# Altium project TinyEmbedded_T133.PrjPcb
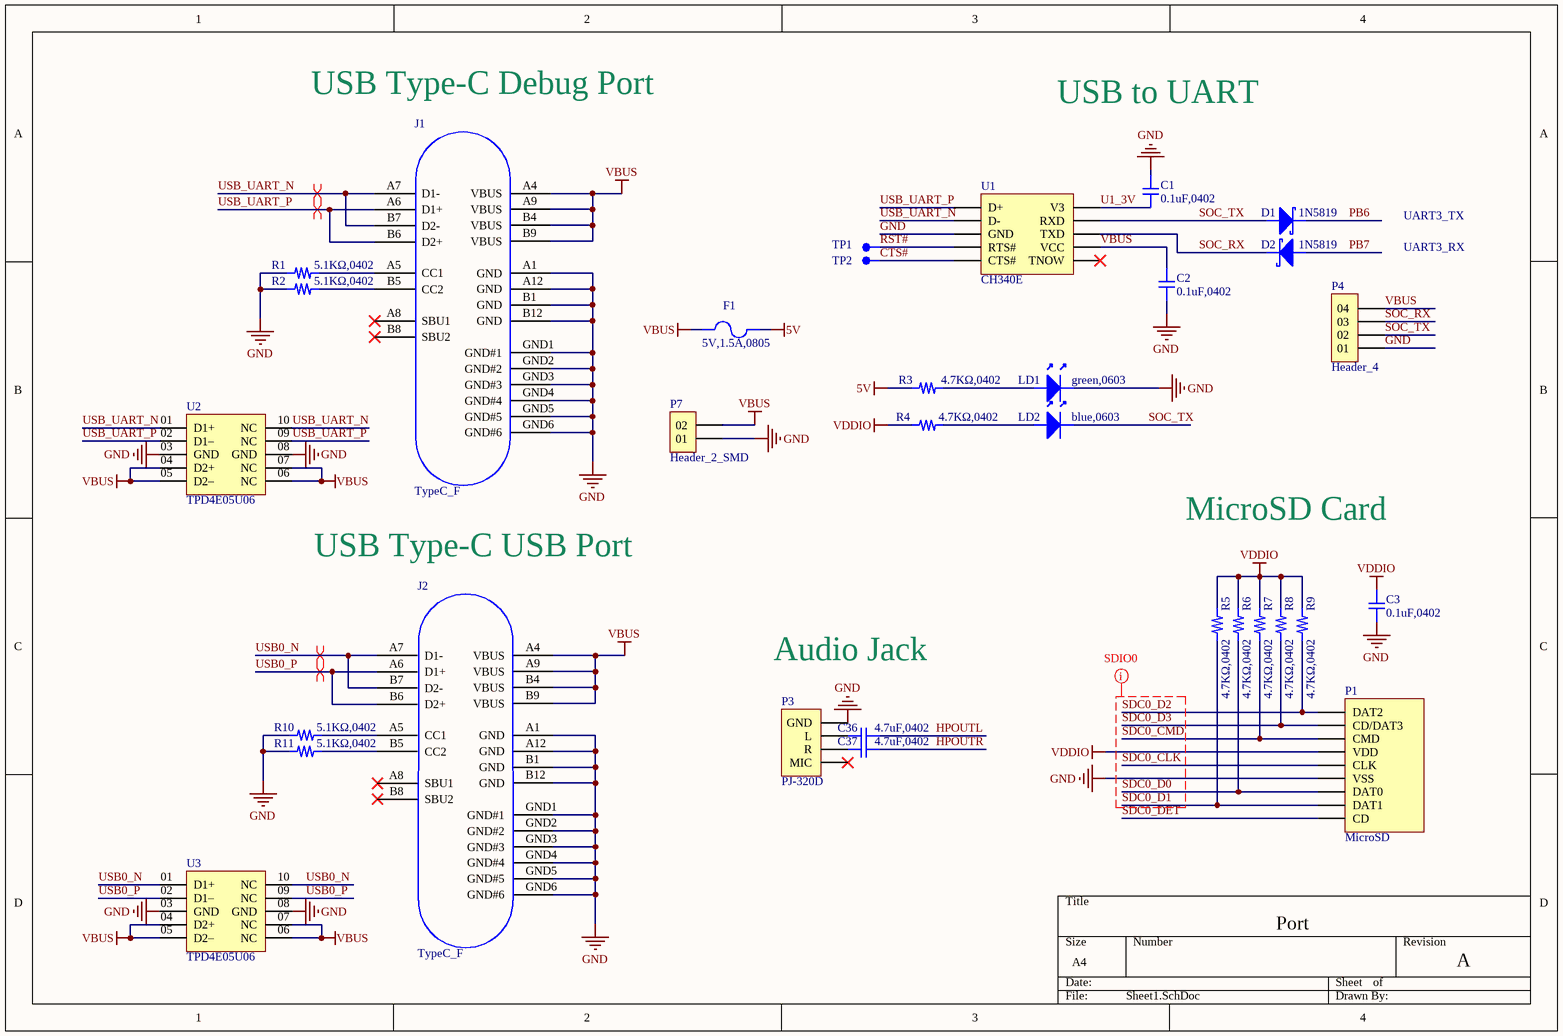
[diagram p0: Sheet1.SchDoc]
4 sheets, 121 parts. Net scope: global (net labels, ports and power ports of the same name join across sheets).
Board files: PCB1.PcbDoc, PCB2.PcbDoc
Sheets:
  Sheet1.SchDoc
  Sheet2.SchDoc
  Sheet3.SchDoc
  Sheet4.SchDoc

## Sheet Sheet1.SchDoc
size A4

### Parts
C1  0.1uF,0402  [C0402]
C2  0.1uF,0402  [C0402]
C3  0.1uF,0402  [C0402]
C36  4.7uF,0402  [C0402]
C37  4.7uF,0402  [C0402]
D1  1N5819  [SOD-323]
D2  1N5819  [SOD-323]
F1  5V,1.5A,0805  [F0805]
J1  TypeC_F  [Type-C_16P_F_0.5_DIP]
J2  TypeC_F  [Type-C_16P_F_0.5_DIP]
LD1  green,0603  [LED0603]
LD2  blue,0603  [LED0603]
P1  MicroSD  [MicroSD]
P3  PJ-320D  [PJ-320D]
P4  Header_4  [HEADER_4_SMD]
P7  Header_2_SMD  [HEADER_2_SMD]
R1  5.1KΩ,0402  [R0402]
R2  5.1KΩ,0402  [R0402]
R3  4.7KΩ,0402  [R0402]
R4  4.7KΩ,0402  [R0402]
R5  4.7KΩ,0402  [R0402]
R6  4.7KΩ,0402  [R0402]
R7  4.7KΩ,0402  [R0402]
R8  4.7KΩ,0402  [R0402]
R9  4.7KΩ,0402  [R0402]
R10  5.1KΩ,0402  [R0402]
R11  5.1KΩ,0402  [R0402]
TP1  TP  [TP]  (value not drawn)
TP2  TP  [TP]  (value not drawn)
U1  CH340E  [MSOP-10]
U2  TPD4E05U06  [USON-10]
U3  TPD4E05U06  [USON-10]

### Nets
5V: F1.02 R3.01
GND: C1.02 C2.01 C3.01 J1.A1(GND) J1.A12(GND) J1.B1(GND) J1.B12(GND) J1.GND1(GND#1) J1.GND2(GND#2) J1.GND3(GND#3) J1.GND4(GND#4) J1.GND5(GND#5) J1.GND6(GND#6) J2.A1(GND) J2.A12(GND) J2.B1(GND) J2.B12(GND) J2.GND1(GND#1) J2.GND2(GND#2) J2.GND3(GND#3) J2.GND4(GND#4) J2.GND5(GND#5) J2.GND6(GND#6) LD1.02 P1.06(VSS) P3.01(GND) P4.01 P7.01 R1.01 R2.01 R10.01 R11.01 U1.03(GND) U2.03(GND) U2.08(GND) U3.03(GND) U3.08(GND)
VBUS: C2.02 F1.01 J1.A4(VBUS) J1.A9(VBUS) J1.B4(VBUS) J1.B9(VBUS) J2.A4(VBUS) J2.A9(VBUS) J2.B4(VBUS) J2.B9(VBUS) P4.04 P7.02 U1.07(VCC) U2.04(D2+) U2.05(D2–) U2.06(NC) U2.07(NC) U3.04(D2+) U3.05(D2–) U3.06(NC) U3.07(NC)
VDDIO: C3.02 P1.04(VDD) R4.01 R5.02 R6.02 R7.02 R8.02 R9.02
CTS#: TP2.01 U1.05(CTS#)
HPOUTL: C36.01
HPOUTR: C37.01
PB6: D1.02
PB7: D2.01
RST#: TP1.01 U1.04(RTS#)
SDC0_CLK: P1.05(CLK)
SDC0_CMD: P1.03(CMD) R7.01
SDC0_D0: P1.07(DAT0) R6.01
SDC0_D1: P1.08(DAT1) R5.01
SDC0_D2: P1.01(DAT2) R9.01
SDC0_D3: P1.02(CD/DAT3) R8.01
SDC0_DET: P1.09(CD)
SOC_RX: D2.02 P4.03 U1.08(TXD)
SOC_TX: D1.01 LD2.02 P4.02 U1.09(RXD)
U1_3V: C1.01 U1.10(V3)
USB0_N: J2.A7(D1-) J2.B7(D2-) U3.01(D1+) U3.10(NC)
USB0_P: J2.A6(D1+) J2.B6(D2+) U3.02(D1–) U3.09(NC)
USB_UART_N: J1.A7(D1-) J1.B7(D2-) U1.02(D-) U2.01(D1+) U2.10(NC)
USB_UART_P: J1.A6(D1+) J1.B6(D2+) U1.01(D+) U2.02(D1–) U2.09(NC)
NetC36_02: C36.02 P3.04(L)
NetC37_02: C37.02 P3.03(R)
NetJ1_A5: J1.A5(CC1) R1.02
NetJ1_B5: J1.B5(CC2) R2.02
NetJ2_A5: J2.A5(CC1) R10.02
NetJ2_B5: J2.B5(CC2) R11.02
NetLD1_01: LD1.01 R3.02
NetLD2_01: LD2.01 R4.02

Not connected (* = marked no-connect by the designer): J1 A8(SBU1)* B8(SBU2)*; J2 A8(SBU1)* B8(SBU2)*; P3 02(MIC)*; U1 06(TNOW)*

### Layout directives
differential pair: USB0_N, USB0_P, USB_UART_N, USB_UART_P
net class SDIO0: SDC0_CLK, SDC0_CMD, SDC0_D0, SDC0_D1, SDC0_D2, SDC0_D3

### Notes on the sheet
- USB Type-C Debug Port
- USB to UART
- UART3_TX
- UART3_RX
- USB Type-C USB Port
- MicroSD Card
- Audio Jack
- Port
- A

### Library data of the parts
C1-C3 C36 C37 = Cap
D1 D2 = Diode - Schottky
F1 = Fuse
J1 J2 = Type-C_16P_F_0.5: Female SMD Connector
LD1 LD2 = Diode - LED
P3 = PJ-320D: Audio jack
P7 = Header_2
R1-R11 = Res

## Sheet Sheet2.SchDoc
size A4
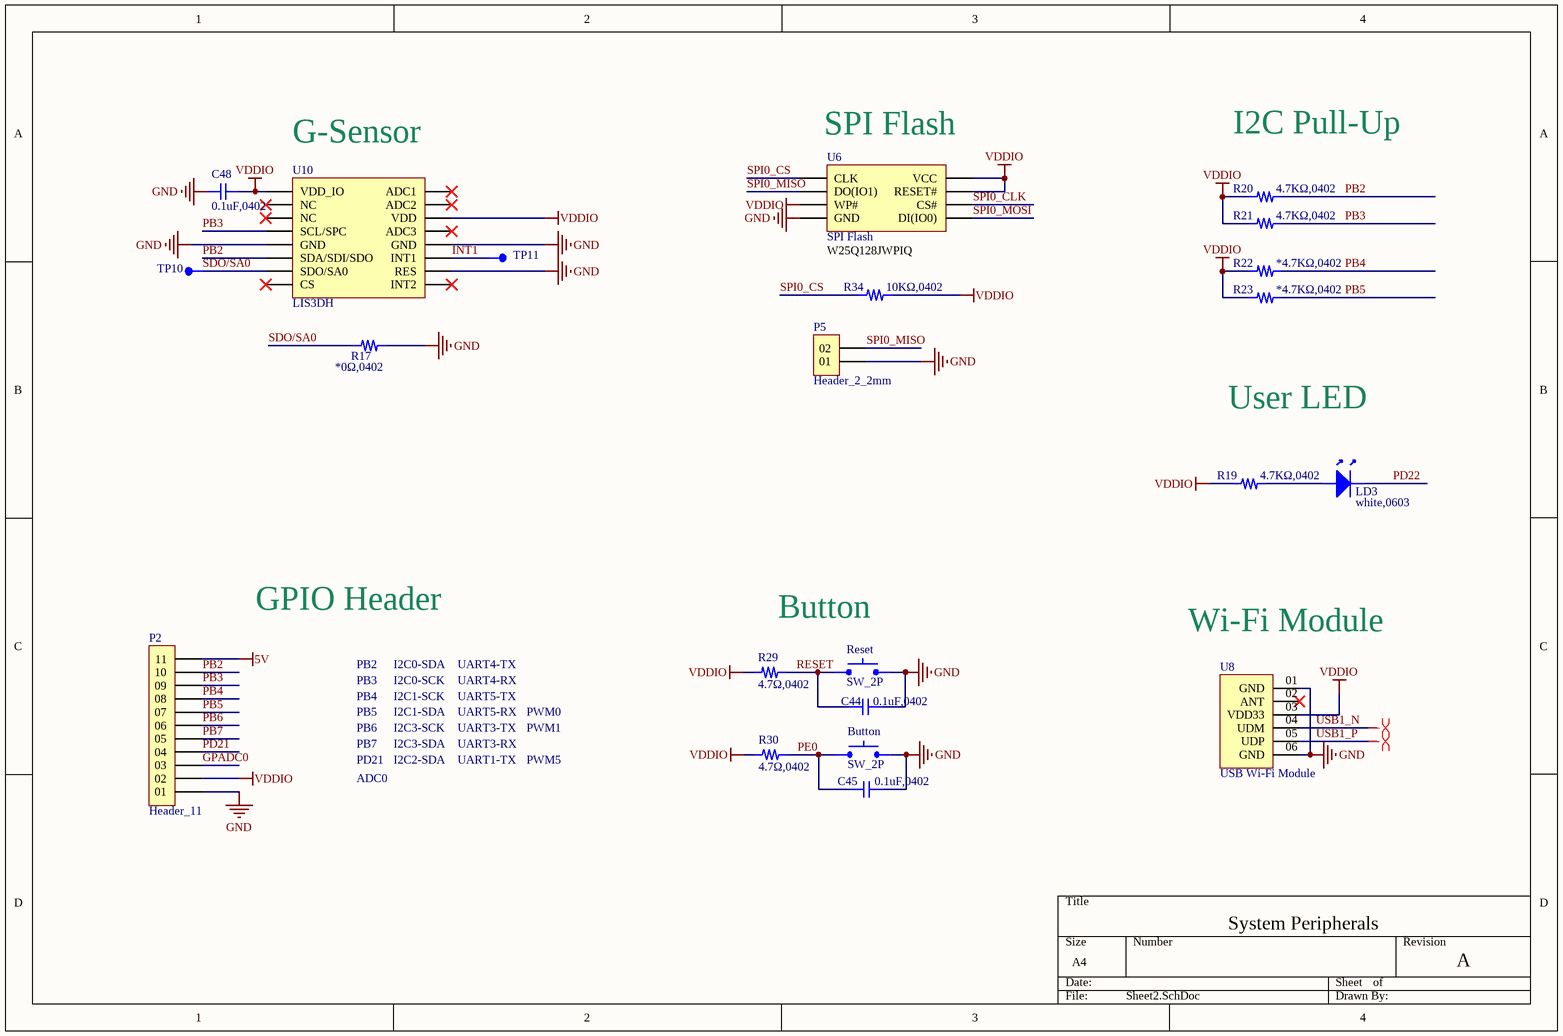
[diagram p1: Sheet2.SchDoc]

### Parts
Button  SW_2P  [SW_2P_4]
C44  0.1uF,0402  [C0402]
C45  0.1uF,0402  [C0402]
C48  0.1uF,0402  [C0402]
LD3  white,0603  [LED0603]
P2  Header_11  [Header_11]
P5  Header_2_2mm  [Header_2_2mm]
R17  *0Ω,0402  [R0402]
R19  4.7KΩ,0402  [R0402]
R20  4.7KΩ,0402  [R0402]
R21  4.7KΩ,0402  [R0402]
R22  *4.7KΩ,0402  [R0402]
R23  *4.7KΩ,0402  [R0402]
R29  4.7Ω,0402  [R0402]
R30  4.7Ω,0402  [R0402]
R34  10KΩ,0402  [R0402]
Reset  SW_2P  [SW_2P_4]
TP10  TP  [TP]  (value not drawn)
TP11  TP  [TP]  (value not drawn)
U6  SPI Flash  [WSON8]
U8  USB Wi-Fi Module  [BL-M8188FU3]
U10  LIS3DH  [LGA-16]

### Nets
5V: P2.11
GND: Button.02 C44.02 C45.02 C48.02 P2.01 P5.01 R17.02 Reset.02 U6.04(GND) U8.01(GND) U8.06(GND) U10.05(GND) U10.10(RES) U10.12(GND)
VDDIO: C48.01 P2.02 R19.02 R20.02 R21.02 R22.02 R23.02 R29.01 R30.01 R34.02 U6.03(WP#) U6.07(RESET#) U6.08(VCC) U8.03(VDD33) U10.01(VDD_IO) U10.14(VDD)
GPADC0: P2.03
INT1: TP11.01 U10.11(INT1)
PB2: P2.10 R20.01 U10.06(SDA/SDI/SDO)
PB3: P2.09 R21.01 U10.04(SCL/SPC)
PB4: P2.08 R22.01
PB5: P2.07 R23.01
PB6: P2.06
PB7: P2.05
PD21: P2.04
PD22: LD3.02
PE0: Button.01 C45.01 R30.02
RESET: C44.01 R29.02 Reset.01
SDO/SA0: R17.01 TP10.01 U10.07(SDO/SA0)
SPI0_CLK: U6.01(CS#)
SPI0_CS: R34.01 U6.06(CLK)
SPI0_MISO: P5.02 U6.02(DO(IO1))
SPI0_MOSI: U6.05(DI(IO0))
USB1_N: U8.04(UDM)
USB1_P: U8.05(UDP)
NetLD3_01: LD3.01 R19.01

Not connected (* = marked no-connect by the designer): U8 02(ANT)*; U10 02(NC)* 03(NC)* 08(CS)* 09(INT2)* 13(ADC3)* 15(ADC2)* 16(ADC1)*

### Layout directives
differential pair: USB1_N, USB1_P

### Notes on the sheet
- (near U10) G-Sensor
- (near U6) SPI Flash
- I2C Pull-Up
- W25Q128JWPIQ
- User LED
- GPIO Header
- Button
- (near U8) Wi-Fi Module
- PB2
- PB3
- PB4
- PB5
- I2C0-SDA
- I2C0-SCK
- I2C1-SCK
- I2C1-SDA
- UART4-TX
- UART4-RX
- UART5-TX
- UART5-RX
- PWM0
- PB6
- PB7
- PD21
- ADC0
- I2C3-SCK
- I2C3-SDA
- I2C2-SDA
- UART3-TX
- UART3-RX
- UART1-TX
- PWM1
- PWM5
- System Peripherals
- A

### Library data of the parts
C44 C45 C48 = Cap
LD3 = Diode - LED
P5 = Header_2
R17 R19-R23 R29 R30 R34 = Res
U8 = USB Wi-Fi Module: BL-M8188FU3 RTL8188FTV

## Sheet Sheet3.SchDoc
size A4
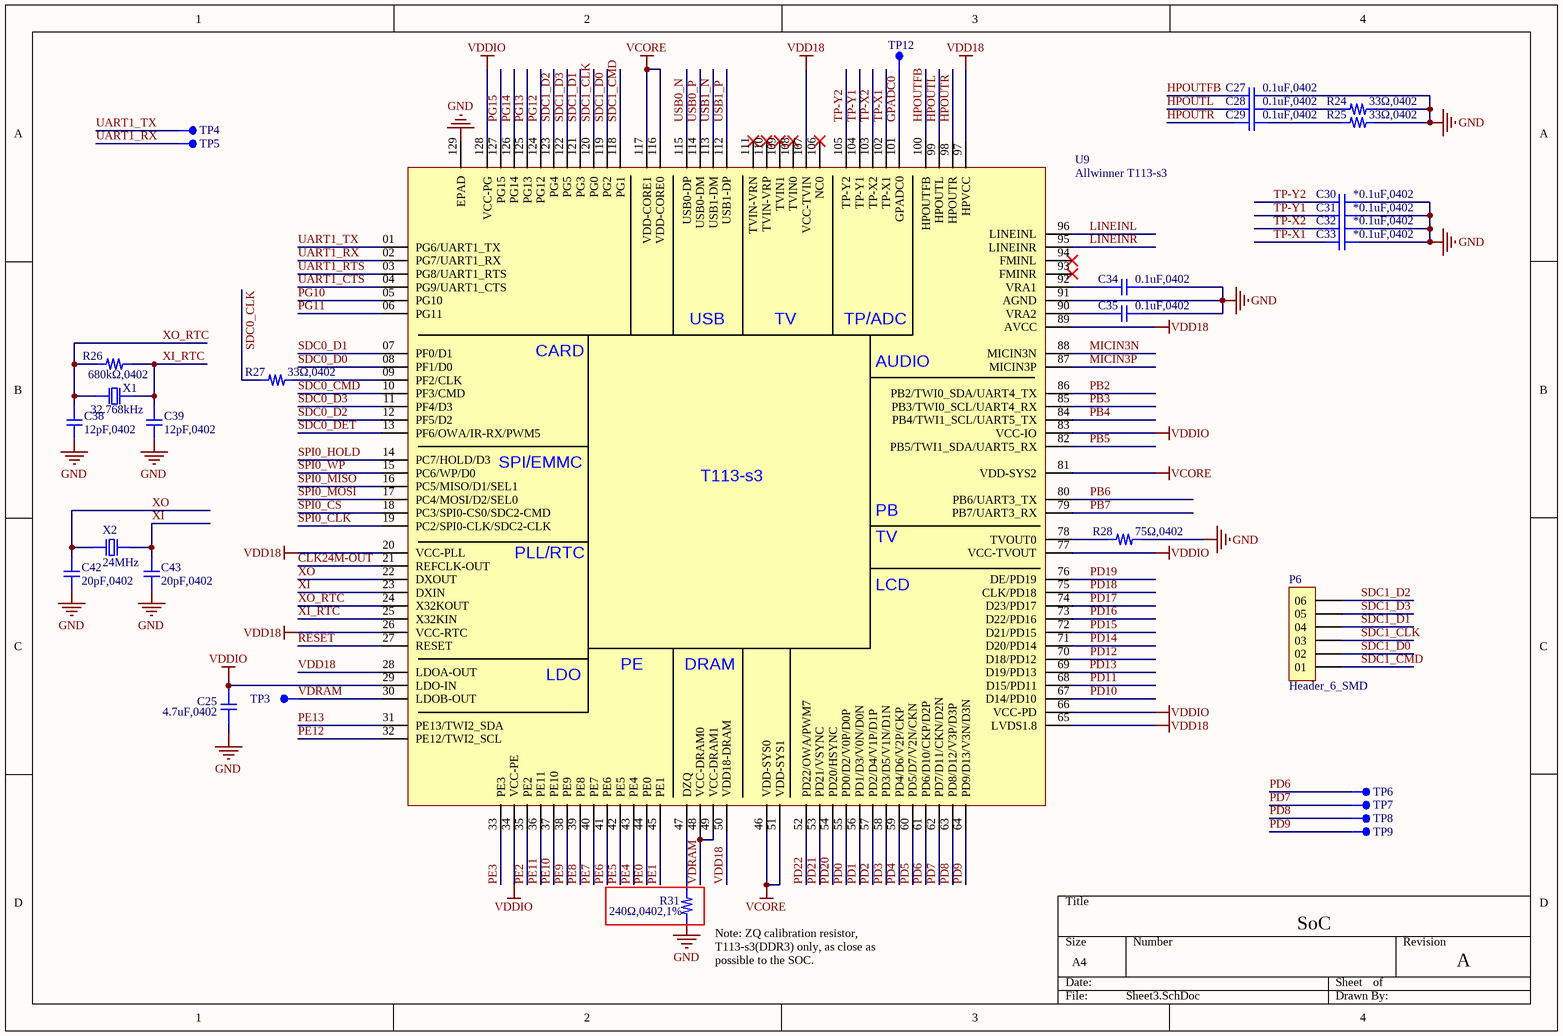
[diagram p2: Sheet3.SchDoc]

### Parts
C25  4.7uF,0402  [C0402]
C27  0.1uF,0402  [C0402]
C28  0.1uF,0402  [C0402]
C29  0.1uF,0402  [C0402]
C30  *0.1uF,0402  [C0402]
C31  *0.1uF,0402  [C0402]
C32  *0.1uF,0402  [C0402]
C33  *0.1uF,0402  [C0402]
C34  0.1uF,0402  [C0402]
C35  0.1uF,0402  [C0402]
C38  12pF,0402  [C0402]
C39  12pF,0402  [C0402]
C42  20pF,0402  [C0402]
C43  20pF,0402  [C0402]
P6  Header_6_SMD  [HEADER_6_SMD]
R24  33Ω,0402  [R0402]
R25  33Ω,0402  [R0402]
R26  680kΩ,0402  [R0402]
R27  33Ω,0402  [R0402]
R28  75Ω,0402  [R0402]
R31  240Ω,0402,1%  [R0402]
TP3  TP  [TP]  (value not drawn)
TP4  TP  [TP]  (value not drawn)
TP5  TP  [TP]  (value not drawn)
TP6  TP  [TP]  (value not drawn)
TP7  TP  [TP]  (value not drawn)
TP8  TP  [TP]  (value not drawn)
TP9  TP  [TP]  (value not drawn)
TP12  TP  [TP]  (value not drawn)
U9  Allwinner T113-s3  [eLQFP128]
X1  32.768kHz  [XTAL_3215_32.768KHz]
X2  24MHz  [XTAL_SMD_3225]

### Nets
GND: C25.01 C27.01 C30.01 C31.01 C32.01 C33.01 C34.01 C35.01 C38.02 C39.02 C42.02 C43.02 R24.01 R25.01 R28.01 R31.02 U9.91(AGND) U9.129(EPAD)
VCORE: U9.46(VDD-SYS0) U9.51(VDD-SYS1) U9.81(VDD-SYS2) U9.116(VDD-CORE0) U9.117(VDD-CORE1)
VDD18: U9.20(VCC-PLL) U9.26(VCC-RTC) U9.28(LDOA-OUT) U9.50(VDD18-DRAM) U9.65(LVDS1.8) U9.89(AVCC) U9.97(HPVCC) U9.107(VCC-TVIN)
VDDIO: C25.02 U9.29(LDO-IN) U9.34(VCC-PE) U9.66(VCC-PD) U9.77(VCC-TVOUT) U9.83(VCC-IO) U9.128(VCC-PG)
VDRAM: TP3.01 U9.30(LDOB-OUT) U9.48(VCC-DRAM0) U9.49(VCC-DRAM1)
CLK24M-OUT: U9.21(REFCLK-OUT)
GPADC0: TP12.01 U9.101(GPADC0)
HPOUTFB: C27.02 U9.100(HPOUTFB)
HPOUTL: C28.02 U9.99(HPOUTL)
HPOUTR: C29.02 U9.98(HPOUTR)
LINEINL: U9.96(LINEINL)
LINEINR: U9.95(LINEINR)
MICIN3N: U9.88(MICIN3N)
MICIN3P: U9.87(MICIN3P)
PB2: U9.86(PB2/TWI0_SDA/UART4_TX)
PB3: U9.85(PB3/TWI0_SCL/UART4_RX)
PB4: U9.84(PB4/TWI1_SCL/UART5_TX)
PB5: U9.82(PB5/TWI1_SDA/UART5_RX)
PB6: U9.80(PB6/UART3_TX)
PB7: U9.79(PB7/UART3_RX)
PD0: U9.55(PD0/D2/V0P/D0P)
PD1: U9.56(PD1/D3/V0N/D0N)
PD2: U9.57(PD2/D4/V1P/D1P)
PD3: U9.58(PD3/D5/V1N/D1N)
PD4: U9.59(PD4/D6/V2P/CKP)
PD5: U9.60(PD5/D7/V2N/CKN)
PD6: TP6.01 U9.61(PD6/D10/CKP/D2P)
PD7: TP7.01 U9.62(PD7/D11/CKN/D2N)
PD8: TP8.01 U9.63(PD8/D12/V3P/D3P)
PD9: TP9.01 U9.64(PD9/D13/V3N/D3N)
PD10: U9.67(D14/PD10)
PD11: U9.68(D15/PD11)
PD12: U9.70(D18/PD12)
PD13: U9.69(D19/PD13)
PD14: U9.71(D20/PD14)
PD15: U9.72(D21/PD15)
PD16: U9.73(D22/PD16)
PD17: U9.74(D23/PD17)
PD18: U9.75(CLK/PD18)
PD19: U9.76(DE/PD19)
PD20: U9.54(PD20/HSYNC)
PD21: U9.53(PD21/VSYNC)
PD22: U9.52(PD22/OWA/PWM7)
PE0: U9.44(PE0)
PE1: U9.45(PE1)
PE2: U9.35(PE2)
PE3: U9.33(PE3)
PE4: U9.43(PE4)
PE5: U9.42(PE5)
PE6: U9.41(PE6)
PE7: U9.40(PE7)
PE8: U9.39(PE8)
PE9: U9.38(PE9)
PE10: U9.37(PE10)
PE11: U9.36(PE11)
PE12: U9.32(PE12/TWI2_SCL)
PE13: U9.31(PE13/TWI2_SDA)
PG10: U9.05(PG10)
PG11: U9.06(PG11)
PG12: U9.124(PG12)
PG13: U9.125(PG13)
PG14: U9.126(PG14)
PG15: U9.127(PG15)
RESET: U9.27(RESET)
SDC0_CLK: R27.02
SDC0_CMD: U9.10(PF3/CMD)
SDC0_D0: U9.08(PF1/D0)
SDC0_D1: U9.07(PF0/D1)
SDC0_D2: U9.12(PF5/D2)
SDC0_D3: U9.11(PF4/D3)
SDC0_DET: U9.13(PF6/OWA/IR-RX/PWM5)
SDC1_CLK: P6.03 U9.120(PG0)
SDC1_CMD: P6.01 U9.118(PG1)
SDC1_D0: P6.02 U9.119(PG2)
SDC1_D1: P6.04 U9.121(PG3)
SDC1_D2: P6.06 U9.123(PG4)
SDC1_D3: P6.05 U9.122(PG5)
SPI0_CLK: U9.19(PC2/SPI0-CLK/SDC2-CLK)
SPI0_CS: U9.18(PC3/SPI0-CS0/SDC2-CMD)
SPI0_HOLD: U9.14(PC7/HOLD/D3)
SPI0_MISO: U9.16(PC5/MISO/D1/SEL1)
SPI0_MOSI: U9.17(PC4/MOSI/D2/SEL0)
SPI0_WP: U9.15(PC6/WP/D0)
TP-X1: C33.02 U9.102(TP-X1)
TP-X2: C32.02 U9.103(TP-X2)
TP-Y1: C31.02 U9.104(TP-Y1)
TP-Y2: C30.02 U9.105(TP-Y2)
UART1_CTS: U9.04(PG9/UART1_CTS)
UART1_RTS: U9.03(PG8/UART1_RTS)
UART1_RX: TP5.01 U9.02(PG7/UART1_RX)
UART1_TX: TP4.01 U9.01(PG6/UART1_TX)
USB0_N: U9.115(USB0-DP)
USB0_P: U9.114(USB0-DM)
USB1_N: U9.113(USB1-DM)
USB1_P: U9.112(USB1-DP)
XI: C43.01 U9.23(DXIN) X2.01
XI_RTC: C39.01 R26.01 U9.25(X32KIN) X1.01
XO: C42.01 U9.22(DXOUT) X2.02
XO_RTC: C38.01 R26.02 U9.24(X32KOUT) X1.02
NetC28_01: C28.01 R24.02
NetC29_01: C29.01 R25.02
NetC34_02: C34.02 U9.92(VRA1)
NetC35_02: C35.02 U9.90(VRA2)
NetR27_01: R27.01 U9.09(PF2/CLK)
NetR28_02: R28.02 U9.78(TVOUT0)
NetR31_01: R31.01 U9.47(DZQ)

Not connected (* = marked no-connect by the designer): U9 93(FMINR)* 94(FMINL)* 106(NC0)* 108(TVIN0)* 109(TVIN1)* 110(TVIN-VRP)* 111(TVIN-VRN)*

### Notes on the sheet
- (near R31) Note: ZQ calibration resistor, T113-s3(DDR3) only, as close as possible to the SOC.
- SoC
- A
- (in symbol Allwinner T113-s3) USB; TV; TP/ADC; CARD; AUDIO; SPI/EMMC; T113-s3; PB; PLL/RTC; LCD; PE; DRAM; LDO

### Library data of the parts
C25 C27-C35 C38 C39 C42 C43 = Cap
P6 = Header_6
R24-R28 R31 = Res
X1 X2 = XTAL

## Sheet Sheet4.SchDoc
size A4
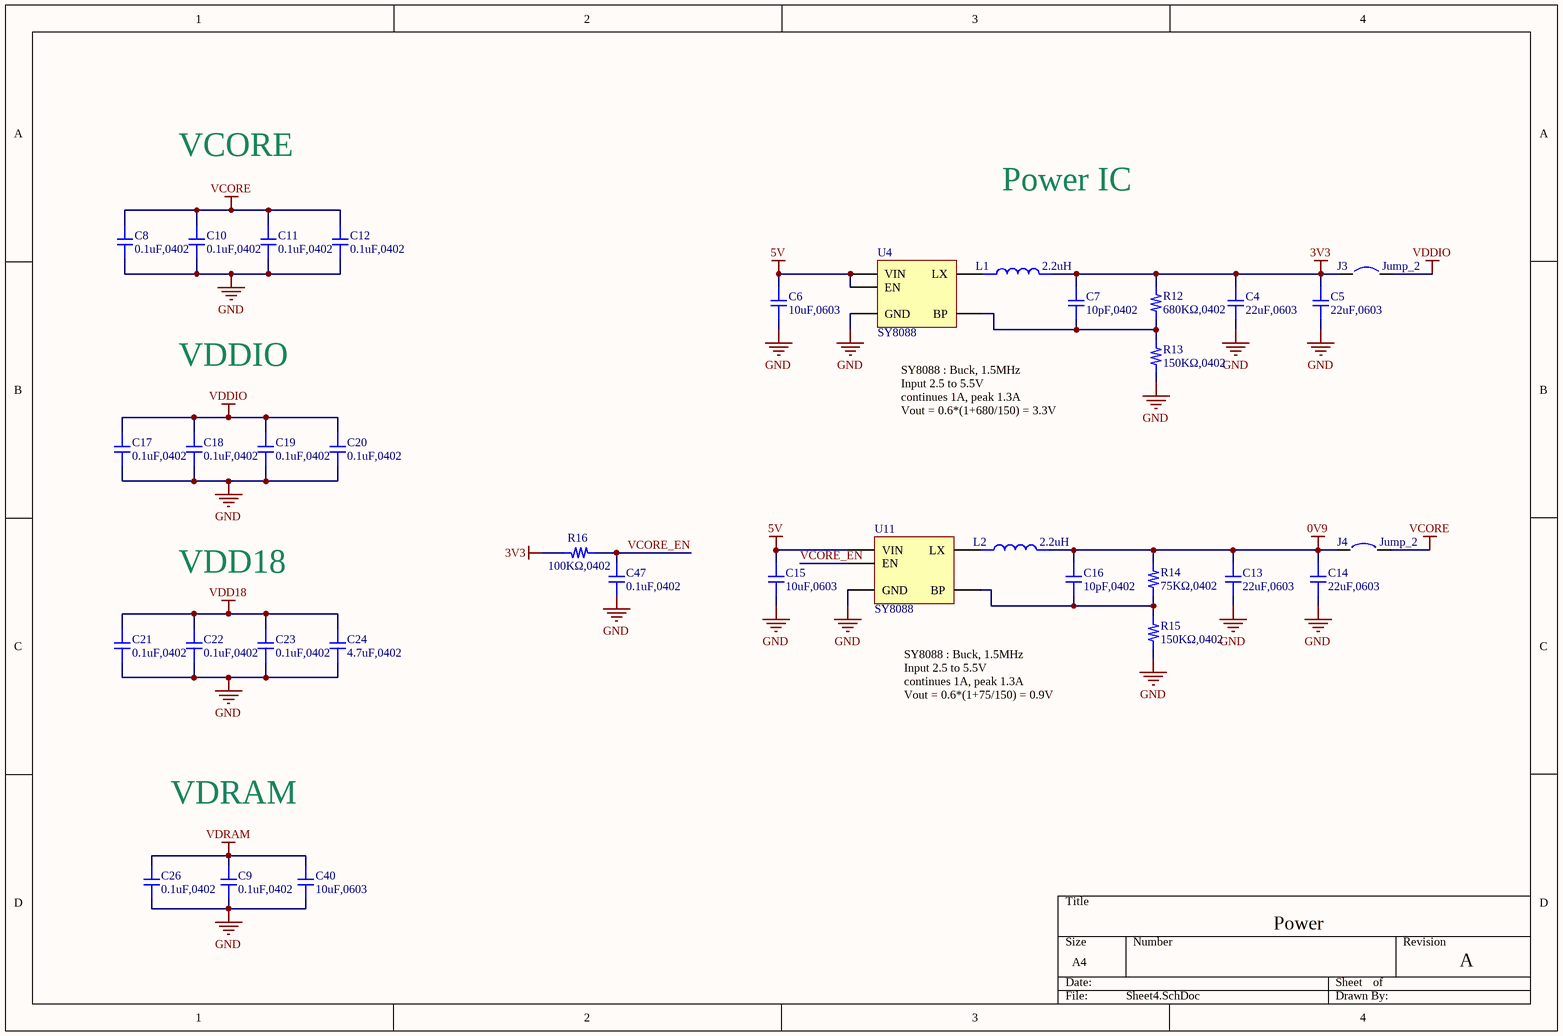
[diagram p3: Sheet4.SchDoc]

### Parts
C4  22uF,0603  [C0603]
C5  22uF,0603  [C0603]
C6  10uF,0603  [C0603]
C7  10pF,0402  [C0402]
C8  0.1uF,0402  [C0402]
C9  0.1uF,0402  [C0402]
C10  0.1uF,0402  [C0402]
C11  0.1uF,0402  [C0402]
C12  0.1uF,0402  [C0402]
C13  22uF,0603  [C0603]
C14  22uF,0603  [C0603]
C15  10uF,0603  [C0603]
C16  10pF,0402  [C0402]
C17  0.1uF,0402  [C0402]
C18  0.1uF,0402  [C0402]
C19  0.1uF,0402  [C0402]
C20  0.1uF,0402  [C0402]
C21  0.1uF,0402  [C0402]
C22  0.1uF,0402  [C0402]
C23  0.1uF,0402  [C0402]
C24  4.7uF,0402  [C0402]
C26  0.1uF,0402  [C0402]
C40  10uF,0603  [C0603]
C47  0.1uF,0402  [C0402]
J3  Jump_2  [Jp0603]
J4  Jump_2  [Jp0603]
L1  2.2uH  [IND_252010_SMD]
L2  2.2uH  [IND_252010_SMD]
R12  680KΩ,0402  [R0402]
R13  150KΩ,0402  [R0402]
R14  75KΩ,0402  [R0402]
R15  150KΩ,0402  [R0402]
R16  100KΩ,0402  [R0402]
U4  SY8088  [SOT-23-5p]
U11  SY8088  [SOT-23-5p]

### Nets
0V9: C13.02 C14.02 C16.01 J4.01 L2.02 R14.01
3V3: C4.02 C5.02 C7.01 J3.01 L1.02 R12.01 R16.02
5V: C6.01 C15.01 U4.01(EN) U4.04(VIN) U11.04(VIN)
GND: C4.01 C5.01 C6.02 C8.01 C9.01 C10.01 C11.01 C12.01 C13.01 C14.01 C15.02 C17.01 C18.01 C19.01 C20.01 C21.01 C22.01 C23.01 C24.01 C26.01 C40.01 C47.01 R13.01 R15.01 U4.02(GND) U11.02(GND)
VCORE: C8.02 C10.02 C11.02 C12.02 J4.02
VDD18: C21.02 C22.02 C23.02 C24.02
VDDIO: C17.02 C18.02 C19.02 C20.02 J3.02
VDRAM: C9.02 C26.02 C40.02
VCORE_EN: C47.02 R16.01 U11.01(EN)
NetC7_02: C7.02 R12.02 R13.02 U4.05(BP)
NetC16_02: C16.02 R14.02 R15.02 U11.05(BP)
NetL1_01: L1.01 U4.03(LX)
NetL2_01: L2.01 U11.03(LX)

### Notes on the sheet
- VCORE
- Power IC
- VDDIO
- SY8088 : Buck, 1.5MHz
  Input 2.5 to 5.5V
  continues 1A, peak 1.3A
  Vout = 0.6*(1+680/150) = 3.3V
- VDD18
- SY8088 : Buck, 1.5MHz
  Input 2.5 to 5.5V
  continues 1A, peak 1.3A
  Vout = 0.6*(1+75/150) = 0.9V
- VDRAM
- Power
- A

### Library data of the parts
C4-C24 C26 C40 C47 = Cap
L1 L2 = Ind
R12-R16 = Res

## Nets that join several sheets
5V: Sheet1 (F1.02 R3.01), Sheet2 (P2.11), Sheet4 (5 pins)
GND: Sheet1 (37 pins), Sheet2 (14 pins), Sheet3 (18 pins), Sheet4 (26 pins)
VCORE: Sheet3 (5 pins), Sheet4 (5 pins)
VDD18: Sheet3 (8 pins), Sheet4 (C21.02 C22.02 C23.02 C24.02)
VDDIO: Sheet1 (8 pins), Sheet2 (16 pins), Sheet3 (7 pins), Sheet4 (5 pins)
VDRAM: Sheet3 (TP3.01 U9.30 U9.48 U9.49), Sheet4 (C9.02 C26.02 C40.02)
GPADC0: Sheet2 (P2.03), Sheet3 (TP12.01 U9.101)
HPOUTL: Sheet1 (C36.01), Sheet3 (C28.02 U9.99)
HPOUTR: Sheet1 (C37.01), Sheet3 (C29.02 U9.98)
PB2: Sheet2 (P2.10 R20.01 U10.06), Sheet3 (U9.86)
PB3: Sheet2 (P2.09 R21.01 U10.04), Sheet3 (U9.85)
PB4: Sheet2 (P2.08 R22.01), Sheet3 (U9.84)
PB5: Sheet2 (P2.07 R23.01), Sheet3 (U9.82)
PB6: Sheet1 (D1.02), Sheet2 (P2.06), Sheet3 (U9.80)
PB7: Sheet1 (D2.01), Sheet2 (P2.05), Sheet3 (U9.79)
PD21: Sheet2 (P2.04), Sheet3 (U9.53)
PD22: Sheet2 (LD3.02), Sheet3 (U9.52)
PE0: Sheet2 (Button.01 C45.01 R30.02), Sheet3 (U9.44)
RESET: Sheet2 (C44.01 R29.02 Reset.01), Sheet3 (U9.27)
SDC0_CLK: Sheet1 (P1.05), Sheet3 (R27.02)
SDC0_CMD: Sheet1 (P1.03 R7.01), Sheet3 (U9.10)
SDC0_D0: Sheet1 (P1.07 R6.01), Sheet3 (U9.08)
SDC0_D1: Sheet1 (P1.08 R5.01), Sheet3 (U9.07)
SDC0_D2: Sheet1 (P1.01 R9.01), Sheet3 (U9.12)
SDC0_D3: Sheet1 (P1.02 R8.01), Sheet3 (U9.11)
SDC0_DET: Sheet1 (P1.09), Sheet3 (U9.13)
SPI0_CLK: Sheet2 (U6.01), Sheet3 (U9.19)
SPI0_CS: Sheet2 (R34.01 U6.06), Sheet3 (U9.18)
SPI0_MISO: Sheet2 (P5.02 U6.02), Sheet3 (U9.16)
SPI0_MOSI: Sheet2 (U6.05), Sheet3 (U9.17)
USB0_N: Sheet1 (J2.A7 J2.B7 U3.01 U3.10), Sheet3 (U9.115)
USB0_P: Sheet1 (J2.A6 J2.B6 U3.02 U3.09), Sheet3 (U9.114)
USB1_N: Sheet2 (U8.04), Sheet3 (U9.113)
USB1_P: Sheet2 (U8.05), Sheet3 (U9.112)